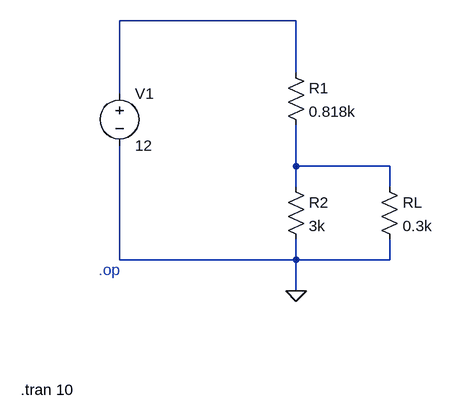
[diagram p0: schematic circuit.asc]
circuit.asc, the LTspice schematic file:
Version 4.1
SHEET 1 880 680
WIRE -64 0 -336 0
WIRE -64 80 -64 0
WIRE -336 112 -336 0
WIRE -64 224 -64 160
WIRE 80 224 -64 224
WIRE -64 256 -64 224
WIRE 80 256 80 224
WIRE -336 368 -336 192
WIRE -64 368 -64 336
WIRE -64 368 -336 368
WIRE 80 368 80 336
WIRE 80 368 -64 368
WIRE -64 416 -64 368
FLAG -64 416 0
DATAFLAG -64 0 ""
DATAFLAG -64 224 "round(V(n002))"
DATAFLAG 80 224 "round(V(n002))"
DATAFLAG 80 368 ""
DATAFLAG -64 400 ""
DATAFLAG 192 304 "round(I(RL)*1k)/1k"
DATAFLAG -112 304 "round(I(R2)*1k)/1k"
DATAFLAG -288 0 "round(-I(V1)*1k)/1k"
SYMBOL voltage -336 96 R0
WINDOW 123 0 0 Left 0
WINDOW 39 0 0 Left 0
SYMATTR InstName V1
SYMATTR Value 12
SYMBOL res -80 64 R0
SYMATTR InstName R1
SYMATTR Value 0.818k
SYMBOL res -80 240 R0
SYMATTR InstName R2
SYMATTR Value 3k
SYMBOL res 64 240 R0
SYMATTR InstName RL
SYMATTR Value 0.3k
TEXT -368 384 Left 2 ;.op
TEXT -488 568 Left 2 !.tran 10

The netlist it stands for:
* circuit.asc
V1 N001 0 12
R1 N001 N002 0.818k
R2 N002 0 3k
RL N002 0 0.3k
* .op
.tran 10
.backanno
.end